# Altium schematic sheet Schematic.SchDoc
size A3; SheetNumber: 1; SheetTotal: 1
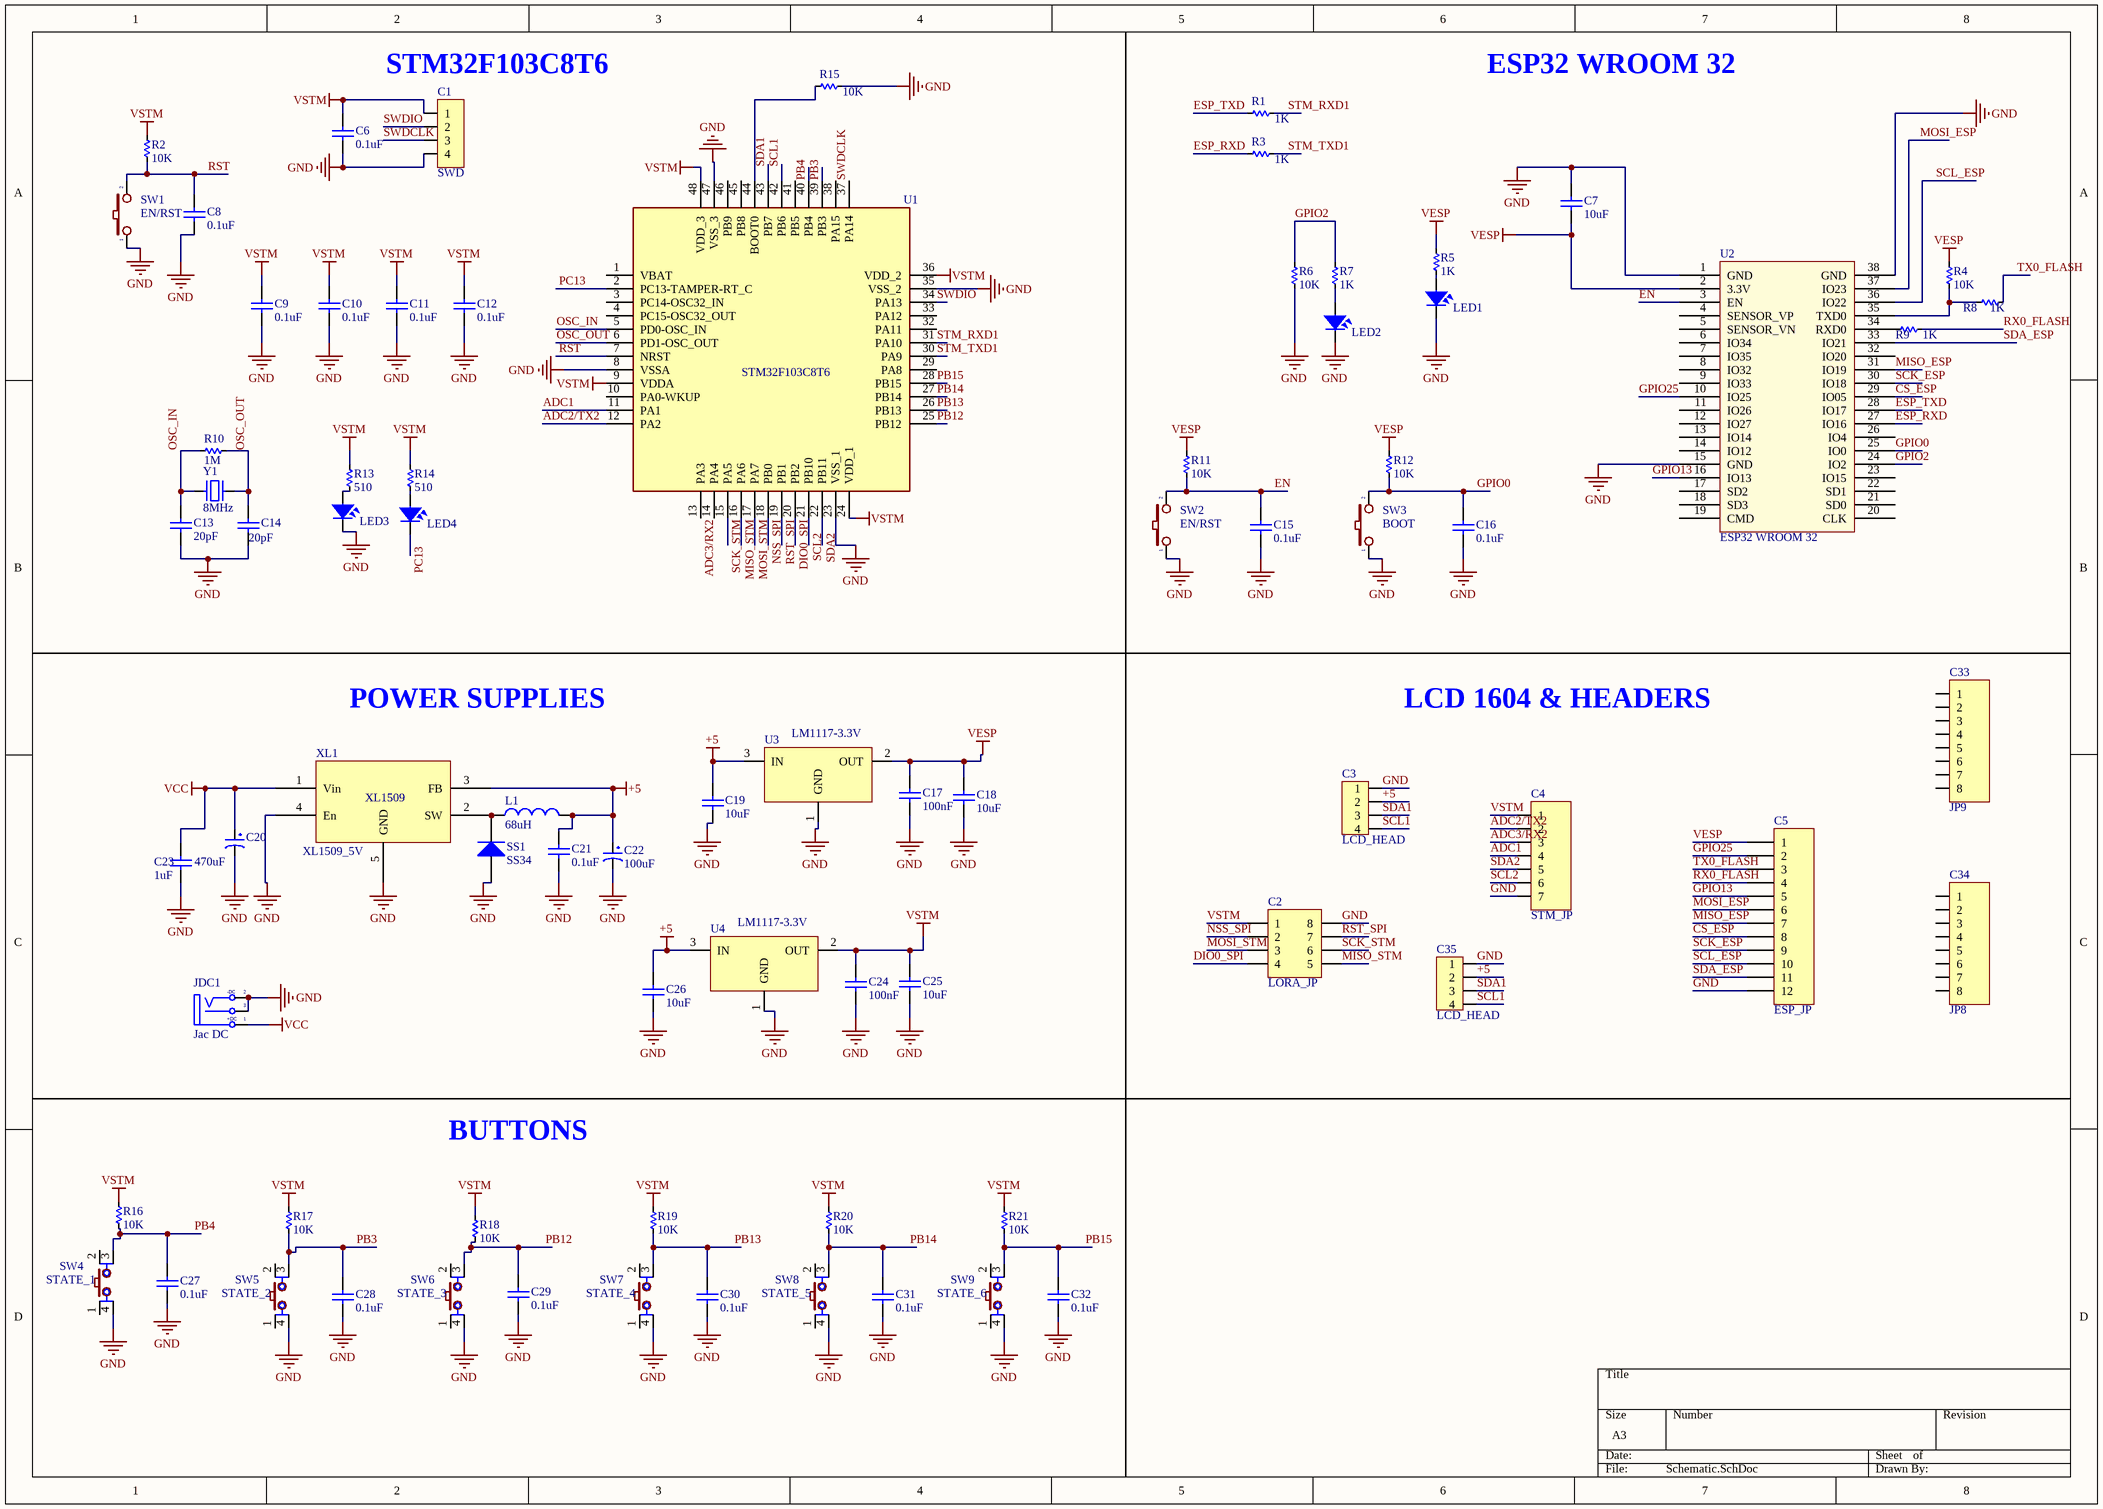
[diagram p0: Schematic.SchDoc]

## Parts
C1  SWD  [JP4-C1T]
C2  LORA_JP  [JP4-C2T]
C3  LCD_HEAD  [HDR4]
C4  STM_JP  [JP7-C1T]
C5  ESP_JP  [JP12-C1T]
C6  0.1uF  [tu 0805]
C7  10uF  [tu 0805]
C8  0.1uF  [tu 0805]
C9  0.1uF  [tu 0805]
C10  0.1uF  [tu 0805]
C11  0.1uF  [tu 0805]
C12  0.1uF  [tu 0805]
C13  20pF  [tu 0805]
C14  20pF  [tu 0805]
C15  0.1uF  [tu 0805]
C16  0.1uF  [tu 0805]
C17  100nF  [tu 0805]
C18  10uF  [tu 0805]
C19  10uF  [tu 0805]
C20  470uF  [tu hoa 8mm]
C21  0.1uF  [tu 0805]
C22  100uF  [tu hoa 5mm]
C23  1uF  [tu 0805]
C24  100nF  [tu 0805]
C25  10uF  [tu 0805]
C26  10uF  [tu 0805]
C27  0.1uF  [tu 0805]
C28  0.1uF  [tu 0805]
C29  0.1uF  [tu 0805]
C30  0.1uF  [tu 0805]
C31  0.1uF  [tu 0805]
C32  0.1uF  [tu 0805]
C33  JP9  [JP8-C1T]
C34  JP8  [JP8-C1T]
C35  LCD_HEAD  [HDR4]
JDC1  Jac DC  [DC0]
L1  68uH  [IND_370_401_140X70_SMD]
LED1  LED  [LED-0805-Green]  (value not drawn)
LED2  LED  [LED-0805-Green]  (value not drawn)
LED3  LED  [LED-0805-Green]  (value not drawn)
LED4  LED  [LED-0805-Green]  (value not drawn)
R1  1K  [RES-SMD-0805]
R2  10K  [RES-SMD-0805]
R3  1K  [RES-SMD-0805]
R4  10K  [RES-SMD-0805]
R5  1K  [RES-SMD-0805]
R6  10K  [RES-SMD-0805]
R7  1K  [RES-SMD-0805]
R8  1K  [RES-SMD-0805]
R9  1K  [RES-SMD-0805]
R10  1M  [RES-SMD-0805]
R11  10K  [RES-SMD-0805]
R12  10K  [RES-SMD-0805]
R13  510  [RES-SMD-0805]
R14  510  [RES-SMD-0805]
R15  10K  [RES-SMD-0805]
R16  10K  [RES-SMD-0805]
R17  10K  [RES-SMD-0805]
R18  10K  [RES-SMD-0805]
R19  10K  [RES-SMD-0805]
R20  10K  [RES-SMD-0805]
R21  10K  [RES-SMD-0805]
SS1  SS34  [DIODE SMA]
SW1  EN/RST  [SW1-SMD]
SW2  EN/RST  [SW1-SMD]
SW3  BOOT  [SW1-SMD]
SW4  STATE_1  [SW2-SMD]
SW5  STATE_2  [SW2-SMD]
SW6  STATE_3  [SW2-SMD]
SW7  STATE_4  [SW2-SMD]
SW8  STATE_5  [SW2-SMD]
SW9  STATE_6  [SW2-SMD]
U1  STM32F103C8T6  [LQFP-48_19.6_393_58X11_SMD]
U2  ESP32 WROOM 32  [ESP32-WROOM-32D]
U3  LM1117-3.3V  [SOT223]
U4  LM1117-3.3V  [SOT223]
XL1  XL1509_5V  [SO8]
Y1  8MHz  [Thach Anh 2 chan SMD]

## Nets
+5: C3.2 C19.2 C21.2 C22.1 C26.2 C35.2 L1.2 U3.3(IN) U4.3(IN) XL1.3(FB)
GND: C1.4 C2.8 C3.1 C4.7 C5.12 C6.1 C7.2 C8.1 C9.1 C10.1 C11.1 C12.1 C13.2 C14.2 C15.1 C16.1 C17.2 C18.1 C19.1 C20.2 C21.1 C22.2 C23.2 C24.2 C25.1 C26.1 C27.1 C28.1 C29.1 C30.1 C31.1 C32.1 C35.1 JDC1.2(TN) JDC1.3(S) LED1.2 LED2.2 LED3.2 R6.2 R15.1 SS1.1(A) SW1.1 SW2.1 SW3.1 SW4.4 SW5.4 SW6.4 SW7.4 SW8.4 SW9.4 U1.8(VSSA) U1.23(VSS_1) U1.35(VSS_2) U1.47(VSS_3) U2.1(GND) U2.15(GND) U2.38(GND) U3.1(GND) U4.1(GND) XL1.4(En) XL1.5(GND)
VCC: C20.1 C23.1 JDC1.1(T) XL1.1(Vin)
VESP: C5.1 C7.1 C17.1 C18.2 R4.1 R5.1 R11.1 R12.1 U2.2(3.3V) U3.2(OUT)
VSTM: C1.1 C2.1 C4.1 C6.2 C9.2 C10.2 C11.2 C12.2 C24.1 C25.2 R2.1 R13.1 R14.1 R16.1 R17.1 R18.1 R19.1 R20.1 R21.1 U1.9(VDDA) U1.24(VDD_1) U1.36(VDD_2) U1.48(VDD_3) U4.2(OUT)
ADC1: C4.4 U1.11(PA1)
ADC2/TX2: C4.2 U1.12(PA2)
ADC3/RX2: C4.3 U1.13(PA3)
CS_ESP: C5.8 U2.29(IO05)
DIO0_SPI: C2.4 U1.20(PB2)
EN: C15.2 R11.2 SW2.2 U2.3(EN)
ESP_RXD: R3.2 U2.27(IO16)
ESP_TXD: R1.2 U2.28(IO17)
GPIO0: C16.2 R12.2 SW3.2 U2.25(IO0)
GPIO2: R6.1 R7.1 U2.24(IO2)
GPIO13: C5.5 U2.16(IO13)
GPIO25: C5.2 U2.10(IO25)
MISO_ESP: C5.7 U2.31(IO19)
MISO_STM: C2.5 U1.16(PA6)
MOSI_ESP: C5.6 U2.37(IO23)
MOSI_STM: C2.3 U1.17(PA7)
NSS_SPI: C2.2 U1.18(PB0)
OSC_IN: C13.1 R10.1 U1.5(PD0-OSC_IN) Y1.2
OSC_OUT: C14.1 R10.2 U1.6(PD1-OSC_OUT) Y1.1
PB3: C28.2 R17.2 SW5.3 U1.39(PB3)
PB4: C27.2 R16.2 SW4.3 U1.40(PB4)
PB12: C29.2 R18.2 SW6.3 U1.25(PB12)
PB13: C30.2 R19.2 SW7.3 U1.26(PB13)
PB14: C31.2 R20.2 SW8.3 U1.27(PB14)
PB15: C32.2 R21.2 SW9.3 U1.28(PB15)
PC13: LED4.2 U1.2(PC13-TAMPER-RT_C)
RST: C8.2 R2.2 SW1.2 U1.7(NRST)
RST_SPI: C2.7 U1.19(PB1)
RX0_FLASH: C5.4 R9.1
SCK_ESP: C5.9 U2.30(IO18)
SCK_STM: C2.6 U1.15(PA5)
SCL1: C3.4 C35.4 U1.42(PB6)
SCL2: C4.6 U1.21(PB10)
SCL_ESP: C5.10 U2.36(IO22)
SDA1: C3.3 C35.3 U1.43(PB7)
SDA2: C4.5 U1.22(PB11)
SDA_ESP: C5.11 U2.33(IO21)
STM_RXD1: R1.1 U1.31(PA10)
STM_TXD1: R3.1 U1.30(PA9)
SWDCLK: C1.3 U1.37(PA14)
SWDIO: C1.2 U1.34(PA13)
TX0_FLASH: C5.3 R8.1
NetL1_1: L1.1 SS1.2(K) XL1.2(SW)
NetLED1_1: LED1.1 R5.2
NetLED2_1: LED2.1 R7.2
NetLED3_1: LED3.1 R13.2
NetLED4_1: LED4.1 R14.2
NetR4_2: R4.2 R8.2 U2.35(TXD0)
NetR9_2: R9.2 U2.34(RXD0)
NetR15_2: R15.2 U1.44(BOOT0)

Not connected (* = marked no-connect by the designer): C33 1 2 3 4 5 6 7 8; C34 1 2 3 4 5 6 7 8; SW4 1 2; SW5 1 2; SW6 1 2; SW7 1 2; SW8 1 2; SW9 1 2; U1 1(VBAT) 3(PC14-OSC32_IN) 4(PC15-OSC32_OUT) 10(PA0-WKUP) 14(PA4) 29(PA8) 32(PA11) 33(PA12) 38(PA15) 41(PB5) 45(PB8) 46(PB9); U2 4(SENSOR_VP) 5(SENSOR_VN) 6(IO34) 7(IO35) 8(IO32) 9(IO33) 11(IO26) 12(IO27) 13(IO14) 14(IO12) 17(SD2) 18(SD3) 19(CMD) 20(CLK) 21(SD0) 22(SD1) 23(IO15) 26(IO4) 32(IO20)

## Notes on the sheet
- STM32F103C8T6
- ESP32 WROOM 32
- POWER SUPPLIES
- LCD 1604 & HEADERS
- BUTTONS
- (in symbol DCIN) -DC; +DC

## Library data of the parts
C1 = JP4: WR-PHD 2.54 mm Angled Socket Header; Manufacturer: W¨¹rth Elektronik eiSos GmbH; partNo: 613004143121; ComponentLink1 Description: Manufacturer; ComponentLink2 Description: Datasheet; NoPins: 04; Created Date: 29 March 2013; ComponentLink1URL: http://www.we-online.com; ComponentLink2URL: http://katalog.we-online.de/em/datasheet/6130xx143121.pdf; Created by: Karrer Zheng
C2 = JP4x2: WR-PHD 2.54 mm Dual Socket Header; Manufacturer: W¨¹rth Elektronik eiSos GmbH; partNo: 61300821821; ComponentLink1 Description: Manufacturer; ComponentLink2 Description: Datasheet; NoPins: 08; Created Date: 29 March 2013; ComponentLink1URL: http://www.we-online.com; ComponentLink2URL: http://katalog.we-online.de/em/datasheet/6130xx21821.pdf; Created by: Karrer Zheng
C3 C35 = Header4: Header IDC, 4 x 1 Pin Vertical 2.54mm Pitch (Non-Boxed, Male); Manufacturer: W¨¹rth Elektronik eiSos GmbH; partNo: 613002143121; ComponentLink1 Description: Manufacturer; ComponentLink2 Description: Datasheet; NoPins: 02; Created Date: 29 March 2013; ComponentLink1URL: http://www.we-online.com; ComponentLink2URL: http://katalog.we-online.de/em/datasheet/6130xx143121.pdf; Created by: Karrer Zheng
C4 = JP7: WR-PHD 2.54 mm Angled Socket Header; Manufacturer: W¨¹rth Elektronik eiSos GmbH; partNo: 613007143121; ComponentLink1 Description: Manufacturer; ComponentLink2 Description: Datasheet; NoPins: 07; Created Date: 29 March 2013; ComponentLink1URL: http://www.we-online.com; ComponentLink2URL: http://katalog.we-online.de/em/datasheet/6130xx143121.pdf; Created by: Karrer Zheng
C5 = JP12: WR-PHD 2.54 mm Angled Socket Header; Manufacturer: W¨¹rth Elektronik eiSos GmbH; partNo: 613012143121; ComponentLink1 Description: Manufacturer; ComponentLink2 Description: Datasheet; NoPins: 12; Created Date: 29 March 2013; ComponentLink1URL: http://www.we-online.com; ComponentLink2URL: http://katalog.we-online.de/em/datasheet/6130xx143121.pdf; Created by: Karrer Zheng
C6 C8-C12 C15-C17 C21 C24 C27-C32 = Tu 0805 104 50V 10%: Dán; Don_Vi: Con; So_Chan: 2; Ten_Linh_Kien: Tụ 0805 104-100nF 10% 50V; Ma_Hang: MH004551; Chung_Loai: Dán; Kieu_Chan: *
C7 C18 C19 C25 C26 = Tu 0805 106 16V 10%: Dán; Ten_Linh_Kien: Tụ 0805 106-10uF 10% 16V; So_Chan: 2; Don_Vi: Con; Ma_Hang: MH004553; Chung_Loai: Dán; Kieu_Chan: *
C13 C14 = Tu 0805 20pF 50V 10%: Dán; Don_Vi: Con; Ten_Linh_Kien: Tụ 0805 20P 10% 50V; So_Chan: 2; Ma_Hang: MH004558; Chung_Loai: Dán; Kieu_Chan: *
C20 = Tu Hoa 470uF 16V 8x11: Cắm; Don_Vi: Con; So_Chan: 2; Ten_Linh_Kien: Tụ Hóa 470uF 16V 8x11MM; Ma_Hang: MH006550; Chung_Loai: Cắm; Kieu_Chan: *
C22 = Tu Hoa 100uF 16V 5x11: Cắm; Don_Vi: Con; So_Chan: 2; Ten_Linh_Kien: Tụ Hóa 100uF 16V 5x11MM; Ma_Hang: MH008417; Chung_Loai: Cắm; Kieu_Chan: *
C23 = Tu 0805 105 50V 10%: Dán; Don_Vi: Con; So_Chan: 2; Ten_Linh_Kien: Tụ 0805 105-1uF 10% 50V; Ma_Hang: MH004552; Chung_Loai: Dán; Kieu_Chan: *
C33 C34 = JP8: WR-PHD 2.54 mm Angled Socket Header; Manufacturer: W¨¹rth Elektronik eiSos GmbH; partNo: 613008143121; ComponentLink1 Description: Manufacturer; ComponentLink2 Description: Datasheet; NoPins: 08; Created Date: 29 March 2013; ComponentLink1URL: http://www.we-online.com; ComponentLink2URL: http://katalog.we-online.de/em/datasheet/6130xx143121.pdf; Created by: Karrer Zheng
JDC1 = DCIN: Jac DC input; Value: Jac DC
L1 = IND_15uH-3.8A-30%-SMD: Fixed Inductors MSS1038 SMT Shielded 15 uH 20 % 3.8 A; Manufacturer: Bourns; Manufacturer Part Number: MSS1038-153MLC; Alternate Part Number-1: NA; Case/Package: SMD; Supplier-1: COILCRAFT SAMPLE; Supplier Part Number-1: MSS1038-153MLC
LED1-LED4 = LED SMD: Value: LED 3 - 5 ly 2 Colour
R1-R21 = Res-SMD: Resistor; Manufacturer: Generic Components; Class: Passive; Published: 08/06/2000; Publisher: Altium Hobart Technology Centre
SS1 = Diode SS34 ( 1N5822 ): Dán; Don_Vi: Con; Ma_Hang: MH002104; Ten_Linh_Kien: Diode SS34 3A 40V SMA ( 1N5822 SS34A); Kieu_Chan: *; Chung_Loai: Dán
SW1-SW3 = SW2: Switch button 2 pin; Value: SW chip 2 pin
SW4-SW9 = SW4: Switch button 4 pin; Value: Button chip 4 pin
U1 = IC_STM32F103C8T6: ARM® Cortex®-M3 STM32F1 Microcontroller IC 32-Bit 72MHz 64KB (64K x 8) FLASH 48-LQFP (7x7) /; Manufacturer: STMicroelectronics; Alternate Part Number-1: NA; Manufacturer Part Number: STM32F103C8T6; Case/Package: LQFP48; Supplier-1: LCSC; Supplier Part Number-1: STM32F103C8T6; ComponentLink1Description: New link; ComponentLink1URL: *
U3 U4 = LM1117: 800mA Low-Dropout Linear Regulator; Creator: Nguyen Ba Bien; Website: http://group3i.net
XL1 = XL1509: pin to pad: 5>5+6+7+8
Y1 = Thach Anh 2 chan SMD: Crystal For all Crystal 2pin.; Value: 4Mhz